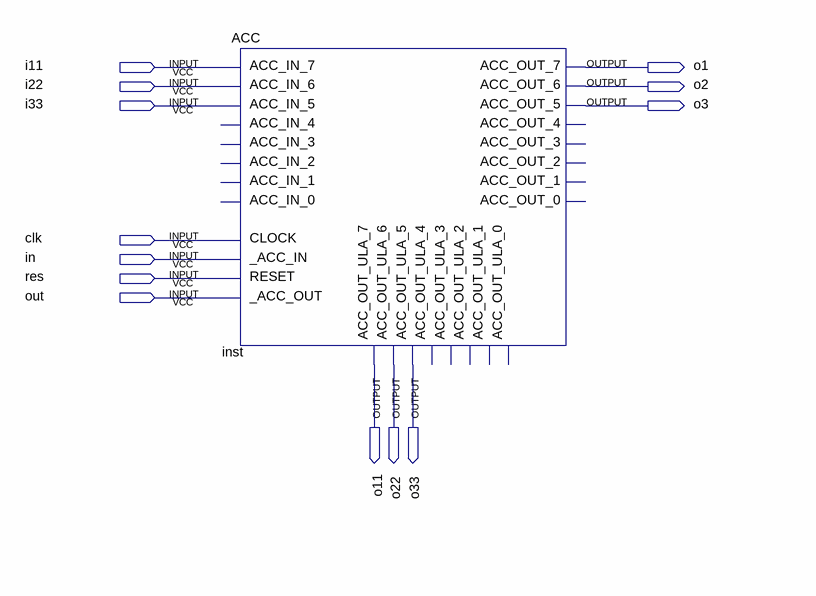
[diagram p0: schematic sheet]
// Quartus schematic teste.bdf as structural Verilog: 1 symbols, 13 pins
module teste (
  input  i11,
  input  i22,
  input  i33,
  input  clk,
  input  in,
  input  res,
  input  out,
  output o1,
  output o2,
  output o3,
  output o11,
  output o22,
  output o33
);

  ACC inst (
    .ACC_IN_7(i11), .ACC_IN_6(i22), .ACC_IN_5(i33), .CLOCK(clk), ._ACC_IN(in), .RESET(res), ._ACC_OUT(out),
    .ACC_OUT_7(o1), .ACC_OUT_6(o2), .ACC_OUT_5(o3), .ACC_OUT_ULA_7(o11), .ACC_OUT_ULA_6(o22),
    .ACC_OUT_ULA_5(o33));  // open: ACC_IN_4, ACC_IN_3, ACC_IN_2, ACC_IN_1, ACC_IN_0, ACC_OUT_4, ACC_OUT_3, ACC_OUT_2, ACC_OUT_1, ACC_OUT_0, ACC_OUT_ULA_4, ACC_OUT_ULA_3, ACC_OUT_ULA_2, ACC_OUT_ULA_1, ACC_OUT_ULA_0
endmodule
